# Altium schematic sheet sch_v3.SchDoc
size B
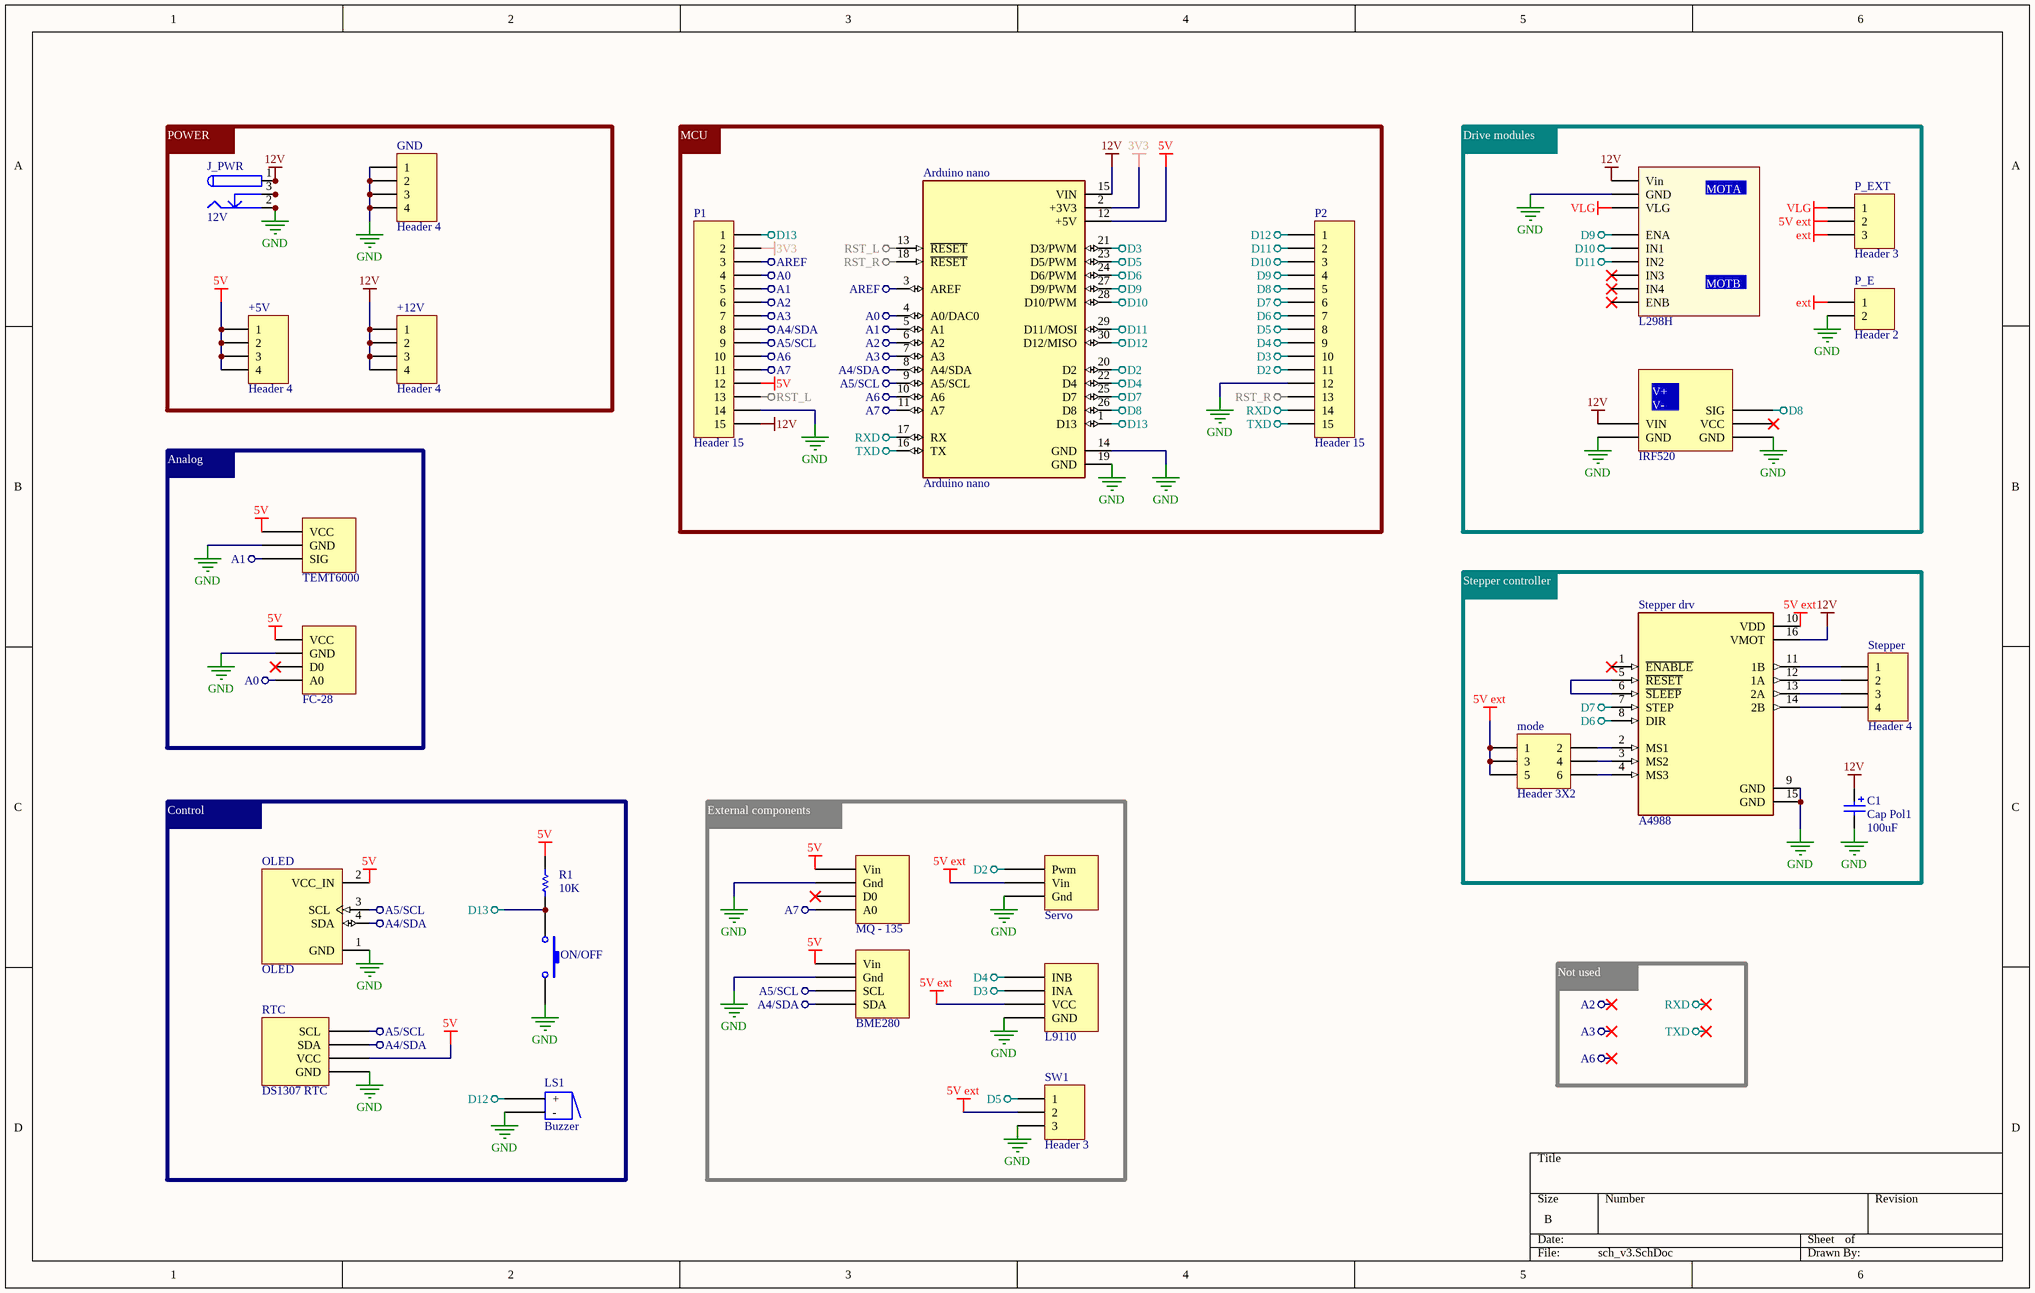
[diagram p0: sch_v3.SchDoc]

## Parts
+5V  Header 4  [HDR1X4]
+12V  Header 4  [HDR1X4]
Arduino_nano  Arduino nano  [arduino nano]
BME280  BME280  [HDR1X4]  (value not drawn)
C1  Cap Pol1  value 100uF  [ELCO-160]
GND  Header 4  [HDR1X4]
IRF520  IRF520  [irf520]  (value not drawn)
J-FC  FC-28  [FC-28]
J_PWR  12V  [KLD-0202]
L298H  L298H  [L298N]
L9110  L9110  [HDR1X4]  (value not drawn)
LS1  Buzzer  [BUZZER]
mode  Header 3X2  [HDR2X3]
MQ_-_135  MQ - 135  [HDR1X4]  (value not drawn)
OLED  OLED  [OLED]
ON/OFF  SW-PB  [SW_B3F-1000]  (value not drawn)
P1  Header 15  [HDR1X15]
P2  Header 15  [HDR1X15]
P_E  Header 2  [HDR1x2]
P_EXT  Header 3  [HDR1x3]
R1  value 10K  [AXIAL-0.3]  (hidden comment: Res1)
RTC  DS1307 RTC  [RTC]
Servo  Servo  [HDR1x3]  (value not drawn)
Stepper  Header 4  [HDR1X4]
Stepper_drv  A4988  [A4988]
SW1  Header 3  [HDR1x3]
TEMT6000  TEMT6000  [temt6000]  (value not drawn)

## Nets
3V3: Arduino_nano.2(+3V3) P1.2
5V: +5V.1 +5V.2 +5V.3 +5V.4 Arduino_nano.12(+5V) BME280.1(Vin) J-FC.1(VCC) MQ_-_135.1(Vin) OLED.2(VCC_IN) P1.12 R1.2 RTC.9(VCC) TEMT6000.1(VCC)
5V ext: L9110.3(VCC) mode.1 mode.3 mode.5 P_EXT.2 Servo.2(Vin) Stepper_drv.10(VDD) SW1.2
12V: +12V.1 +12V.2 +12V.3 +12V.4 Arduino_nano.15(VIN) C1.1 IRF520.4(VIN) J_PWR.1 J_PWR.1A J_PWR.1B L298H.9(Vin) P1.15 Stepper_drv.16(VMOT)
A0: Arduino_nano.4(A0/DAC0) J-FC.4(A0) P1.4
A1: Arduino_nano.5(A1) P1.5 TEMT6000.3(SIG)
A2: Arduino_nano.6(A2) P1.6
A3: Arduino_nano.7(A3) P1.7
A4/SDA: Arduino_nano.8(A4/SDA) BME280.4(SDA) OLED.4(SDA) P1.8 RTC.10(SDA)
A5/SCL: Arduino_nano.9(A5/SCL) BME280.3(SCL) OLED.3(SCL) P1.9 RTC.11(SCL)
A6: Arduino_nano.10(A6) P1.10
A7: Arduino_nano.11(A7) MQ_-_135.4(A0) P1.11
AREF: Arduino_nano.3(AREF) P1.3
D2: Arduino_nano.20(D2) P2.11 Servo.3(Pwm)
D3: Arduino_nano.21(D3/PWM) L9110.2(INA) P2.10
D4: Arduino_nano.22(D4) L9110.1(INB) P2.9
D5: Arduino_nano.23(D5/PWM) P2.8 SW1.1
D6: Arduino_nano.24(D6/PWM) P2.7 Stepper_drv.8(DIR)
D7: Arduino_nano.25(D7) P2.6 Stepper_drv.7(STEP)
D8: Arduino_nano.26(D8) IRF520.1(SIG) P2.5
D9: Arduino_nano.27(D9/PWM) L298H.1(ENA) P2.4
D10: Arduino_nano.28(D10/PWM) L298H.2(IN1) P2.3
D11: Arduino_nano.29(D11/MOSI) L298H.3(IN2) P2.2
D12: Arduino_nano.30(D12/MISO) LS1.P(+) P2.1
D13: Arduino_nano.1(D13) ON/OFF.1 P1.1 R1.1
ext: P_E.1 P_EXT.3
GND: Arduino_nano.14(GND) Arduino_nano.19(GND) BME280.2(Gnd) C1.2 GND.1 GND.2 GND.3 GND.4 IRF520.3(GND) IRF520.5(GND) J-FC.2(GND) J_PWR.2 J_PWR.2A J_PWR.2B L298H.8(GND) L9110.4(GND) LS1.N(-) MQ_-_135.2(Gnd) OLED.1(GND) ON/OFF.2 P1.14 P2.12 P_E.2 RTC.8(GND) Servo.1(Gnd) Stepper_drv.9(GND) Stepper_drv.15(GND) SW1.3 TEMT6000.2(GND)
RST_L: Arduino_nano.13(~{RESET}) P1.13
RST_R: Arduino_nano.18(~{RESET}) P2.13
RXD: Arduino_nano.17(RX) P2.14
TXD: Arduino_nano.16(TX) P2.15
VLG: L298H.7(VLG) P_EXT.1
NetJ_PWR_3: J_PWR.3 J_PWR.3A J_PWR.3B
Netmode_2: mode.2 Stepper_drv.2(MS1)
Netmode_4: mode.4 Stepper_drv.3(MS2)
Netmode_6: mode.6 Stepper_drv.4(MS3)
NetStepper_1: Stepper.1 Stepper_drv.11(1B)
NetStepper_2: Stepper.2 Stepper_drv.12(1A)
NetStepper_3: Stepper.3 Stepper_drv.13(2A)
NetStepper_4: Stepper.4 Stepper_drv.14(2B)
NetStepper_drv_5: Stepper_drv.5(~{RESET}) Stepper_drv.6(~{SLEEP})

Not connected (* = marked no-connect by the designer): IRF520 2(VCC)*; J-FC 3(D0)*; L298H 4(IN3)* 5(IN4)* 6(ENB)*; MQ_-_135 3(D0)*; Stepper_drv 1(~{ENABLE})*

## Notes on the sheet
- (near J_PWR) POWER
- MCU
- Drive modules
- Analog
- Stepper controller
- Control
- (near MQ_-_135) External components
- Not used
- Labels drawn without touching a wire or pin: A2, A3, A6, RXD, TXD
- (in symbol IRF520) V+ / V-
- (in symbol L298H) MOTA; MOTB

## Library data of the parts
+5V +12V GND Stepper = Header 4: Header, 4-Pin; LatestRevisionDate: 17-Jul-2002; LatestRevisionNote: Re-released for DXP Platform.; Publisher: Altium Limited
Arduino_nano = Arduino nano: Arduino nano 5V; MP: Arduino Nano Every; Check_prices: https://www.snapeda.com/parts/Arduino%20Nano%20Every/Arduino/view-part/?ref=eda; Value: *; Availability: Not in stock; Price: None; Package: None; SnapEDA_Link: https://www.snapeda.com/parts/Arduino%20Nano%20Every/Arduino/view-part/?ref=snap; MF: Arduino
C1 = Cap Pol1: Polarized Capacitor (Radial); Published: 8-Jun-2000; LatestRevisionDate: 17-Jul-2002; LatestRevisionNote: Re-released for DXP Platform.; PackageReference: RB7.6-15; Publisher: Altium Limited; PackageDescription: Polarized Capacitor (Radial); 2 Leads
J-FC = FC-28: Ð”Ð°Ñ‚Ñ‡Ð¸Ðº Ð’Ð»Ð°Ð´Ð½Ð¾ÑÑ‚Ð¸ Ð¿Ð¾Ñ‡Ð²Ñ‹ FC-28; Package: None; Price: None; Value: *; MP: FC-28; Availability: Unavailable
J_PWR = PWR2.5: Low Voltage Power Supply Connector; Published: 17-Dec-2003; DatasheetDocument: 09-May-2002; Publisher: Altium Limited; ComponentLink1Description: Manufacturer Link; ComponentLink1URL: http://domino.kycon.com/internet/Products.html
LS1 = Buzzer: Magnetic Transducer Buzzer; Published: 24-Mar-1999; LatestRevisionDate: 17-Dec-2003; LatestRevisionNote: Schematic revised, PCB Footprint replaced.; DatasheetVersion: 17-Dec-2003; PackageReference: ABSM-1574; Publisher: Altium Limited; PackageDescription: Magnetic Transducer Buzzer; ComponentLink1Description: Manufacturer Link; ComponentLink1URL: http://www.megastar.com/linecard/buzzmode/index.php
mode = Header 3X2: Header, 3-Pin, Dual row; LatestRevisionDate: 17-Jul-2002; LatestRevisionNote: Re-released for DXP Platform.; Publisher: Altium Limited
OLED = OLED: 0.96â€ 128 X 64 MONOCHROME GRAPHIC OLED DISPLAY MODULE - I2C; MP: DM-OLED096-636; SnapEDA_Link: https://www.snapeda.com/parts/DM-OLED096-636/Display+Module/view-part/?ref=snap; Package: Package; Value: *; MF: Display Module; Check_prices: https://www.snapeda.com/parts/DM-OLED096-636/Display+Module/view-part/?ref=eda
ON/OFF = SW-PB: Switch; Published: 24-Mar-1999; LatestRevisionDate: 17-Jul-2002; LatestRevisionNote: Re-released for DXP Platform.; PackageReference: SPST-2; Publisher: Altium Limited; PackageDescription: Switch; 2 Leads
P1 P2 = Header 15: Header, 30-Pin; LatestRevisionDate: 17-Jul-2002; LatestRevisionNote: Re-released for DXP Platform.; Publisher: Altium Limited
P_E = Header 2: Header, 2-Pin; LatestRevisionDate: 17-Jul-2002; LatestRevisionNote: Re-released for DXP Platform.; Publisher: Altium Limited
P_EXT SW1 = Header 3: Header, 3-Pin; LatestRevisionDate: 17-Jul-2002; LatestRevisionNote: Re-released for DXP Platform.; Publisher: Altium Limited
R1 = Res1: Resistor; Published: 8-Jun-2000; LatestRevisionDate: 17-Jul-2002; LatestRevisionNote: Re-released for DXP Platform.; PackageReference: AXIAL-0.3; Publisher: Altium Limited; PackageDescription: Axial Device, Thru-Hole; 2 Leads; 0.3 in Pin Spacing
Stepper_drv = A4988: Stepper motor controler; IC: A4988; 1A; Uin mot: 8Ã·35V; MP: A4988_STEPPER_MOTOR_DRIVER_CARRIER; Price: None; Value: *; Package: None; Availability: Unavailable